# Altium schematic sheet PAGE2 - PWR, MODULE.SchDoc (part 2 of 3)
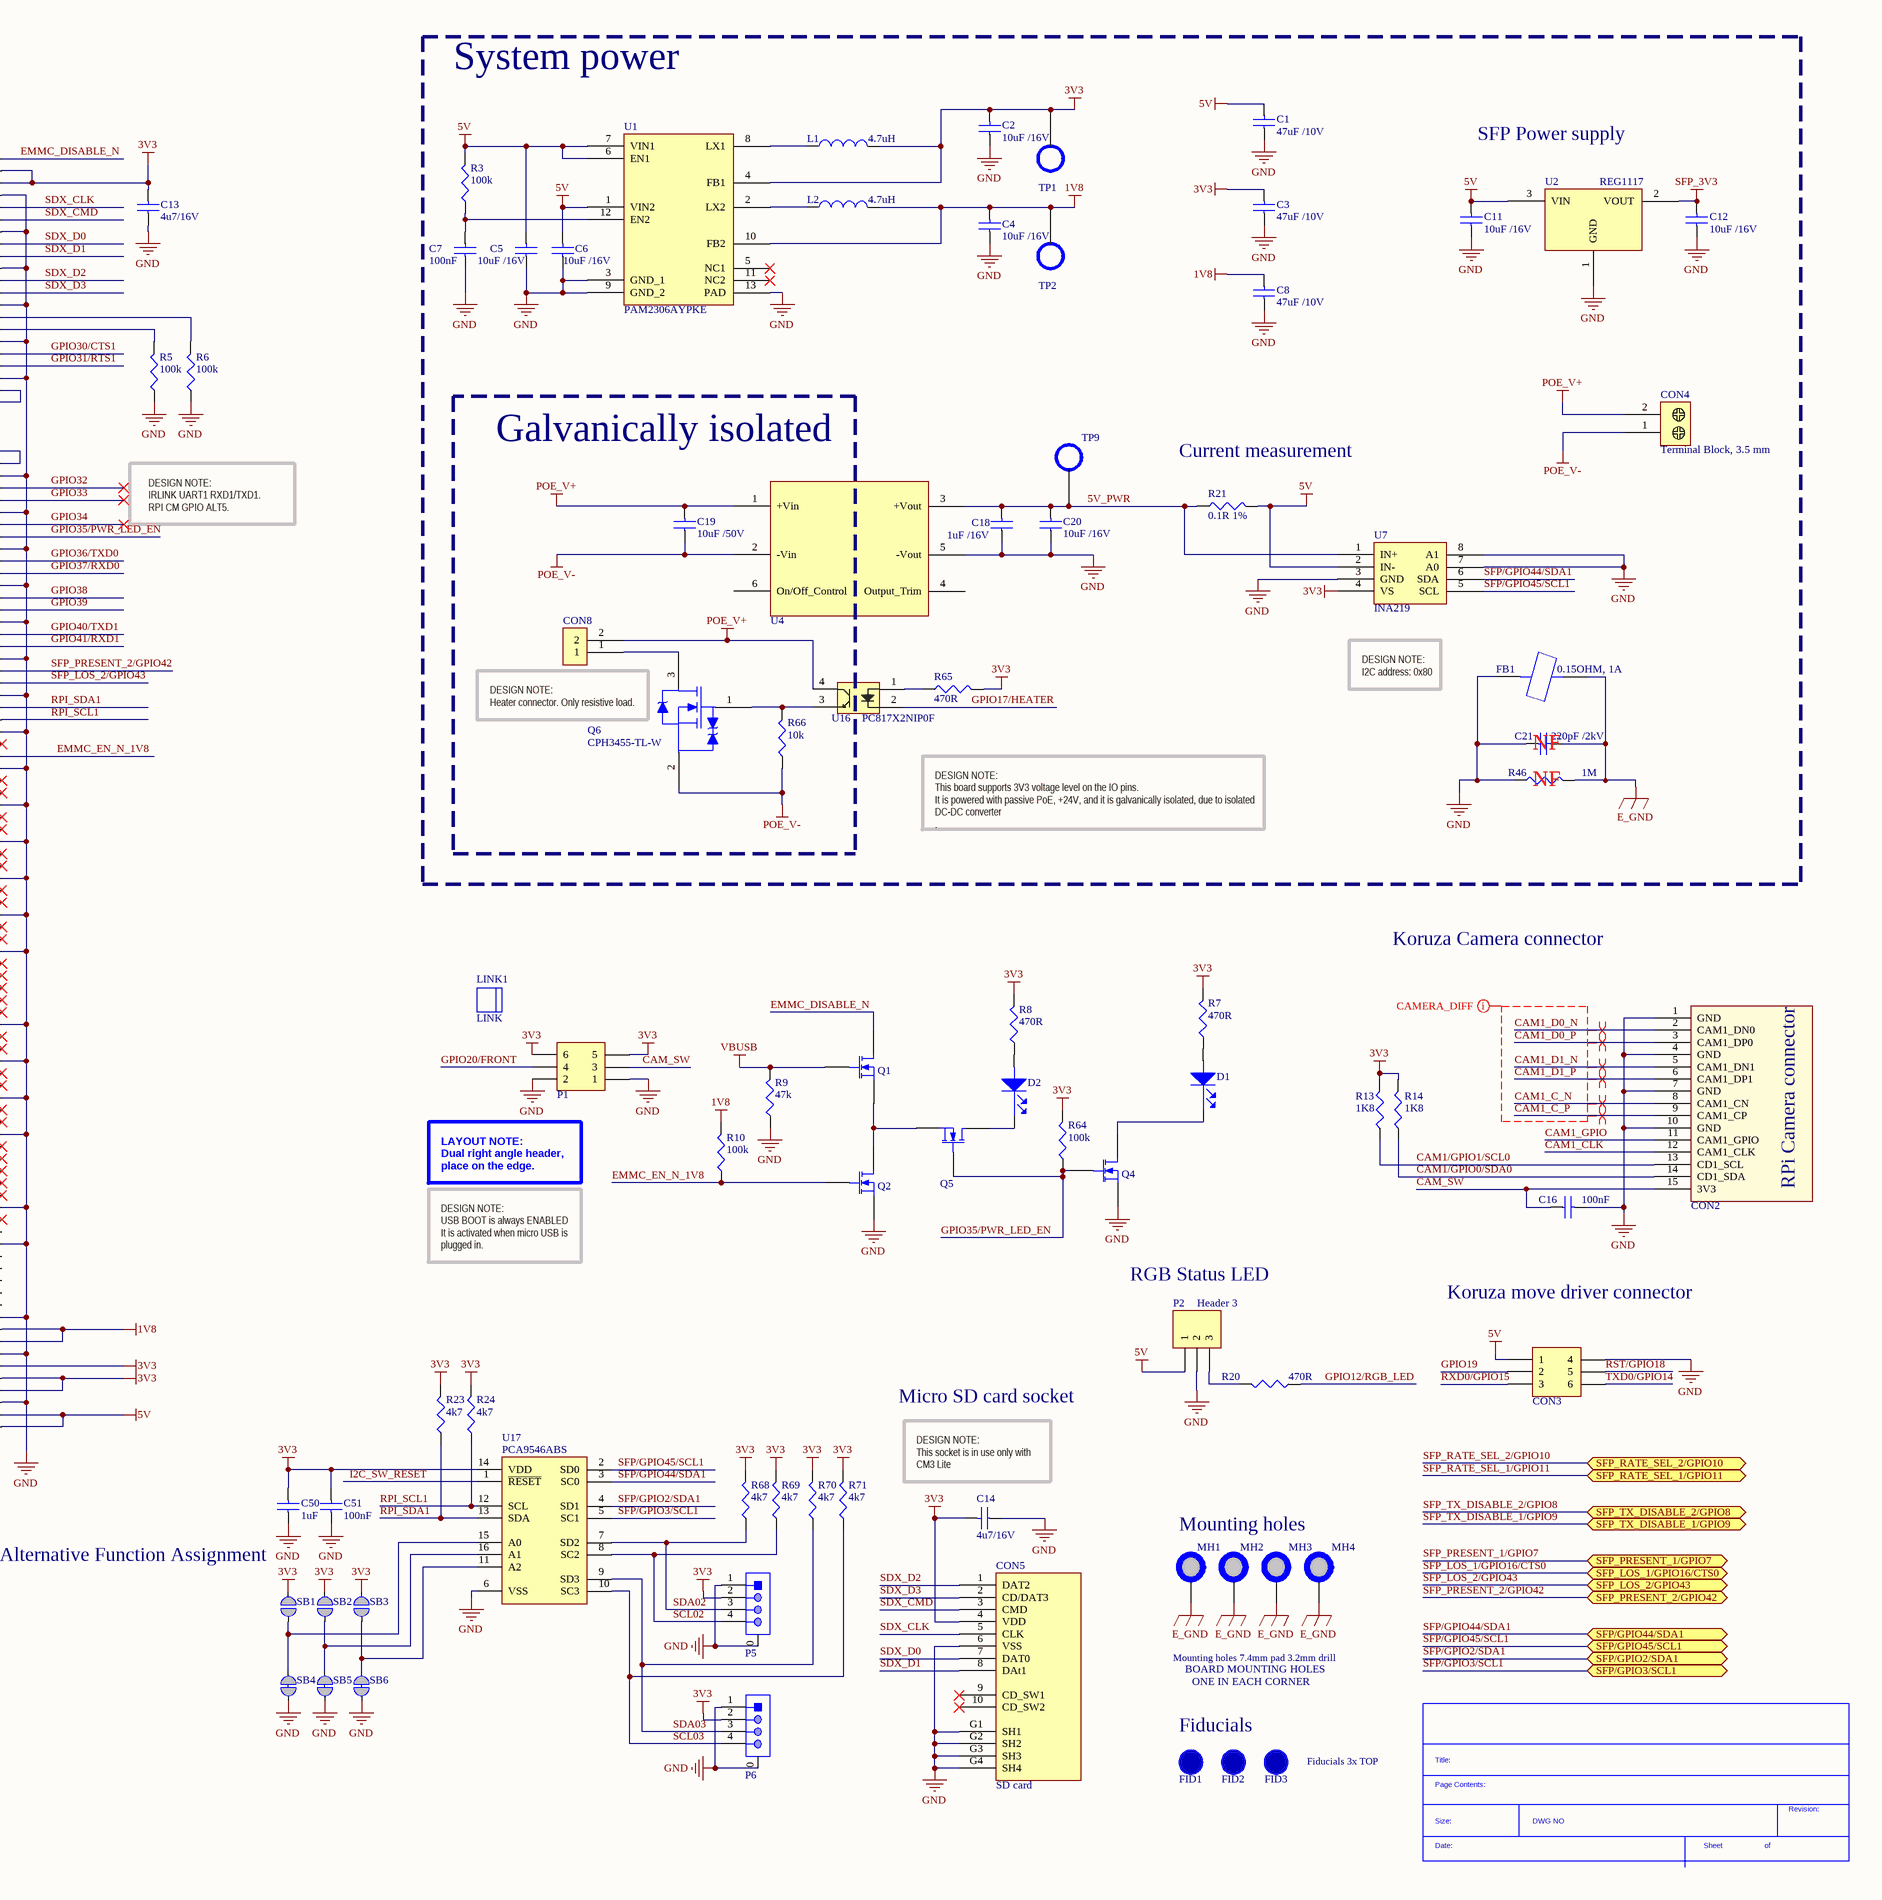
[diagram p2: PAGE2 - PWR, MODULE.SchDoc, right]
## Library data of the parts
C1 C3 C8 = GRM21BR61A476ME15L: MURATA - GRM21BR61A476ME15L - CAP, MLCC, X5R, 47UF, 10V, 0805; Ceramic Capacitor Case: 0805 [2012 Metric]; Capacitance: 47; Voltage Rating: 10; Capacitance Tolerance: ± 20%; Dielectric Characteristic: X5; Product Range: GRM Series; SVHC: No SVHC (17-Dec-2015; Supplier 1: Farnell; Manufacturer: MURATA; Manufacturer Part Number: GRM21BR61A476ME15L; RoHS: YES; Stock 1: 27604; Pricing 1: 5=0.699, 50=0.295, 250=0.232, 500=0.193, 1500=0.171 (GBP); Packaging: Cut Tape; Operating Temperature Min: -55; Operating Temperature Max: 85; Automotive Qualification Standard: -; MSL: MSL 1 - Unlimited; ComponentLink1URL: http://www.farnell.com/datasheets/2079183.pdf; ComponentLink1Description: http://www.farnell.com/datasheets/2079183.pdf; Supplier Part Number 1: 2611939
C2 C4-C6 C20 = CGA4J1X5R1C106K125AC: TDK - CGA4J1X5R1C106K125AC - CAP, MLCC, X5R, 10UF, 16V, 0805; Supplier 1: Farnell; Manufacturer: TDK; Manufacturer Part Number: CGA4J1X5R1C106K125AC; RoHS: YES; Stock 1: 8974; Pricing 1: 5=0.41, 50=0.146, 250=0.131, 500=0.12, 1000=0.103 (GBP); ComponentLink1URL: http://bcove.me/e1v54mtm; ComponentLink1Description: http://bcove.me/e1v54mtm; ComponentLink2URL: http://www.farnell.com/datasheets/1936565.pdf; ComponentLink2Description: http://www.farnell.com/datasheets/1936565.pdf; ComponentLink3URL: http://www.farnell.com/datasheets/1683658.pdf; ComponentLink3Description: http://www.farnell.com/datasheets/1683658.pdf; Supplier Part Number 1: 2210948RL
C7 C16 = 100nF: MURATA - GRM188R71C104KA01J - CAP, MLCC, X7R, 0.1UF, 16V, 0603; Ceramic Capacitor Case: 0603 [1608 Metric]; Capacitance: 0.1; Voltage Rating: 16; Capacitance Tolerance: ± 10%; Dielectric Characteristic: X7; Product Range: GRM Series; SVHC: No SVHC (20-Jun-2016; Supplier 1: Farnell; Manufacturer: MURATA; Manufacturer Part Number: GRM188R71C104KA01J; RoHS: YES; Stock 1: 18297; Pricing 1: 10=0.0145, 100=0.0126, 500=0.0081, 2500=0.0059, 5000=0.0052, 10000=0.0046, 50000=0.0036, 100000=0.0035 (GBP); Packaging: Cut Tape; Operating Temperature Min: -55; Operating Temperature Max: 125; Automotive Qualification Standard: -; MSL: MSL 1 - Unlimited; ComponentLink1URL: http://www.farnell.com/datasheets/2189124.pdf; ComponentLink1Description: http://www.farnell.com/datasheets/2189124.pdf; Supplier Part Number 1: 2688519
C9 C10 = GRM188R61C105KA12D: MURATA - GRM188R61C105KA12D - CAP, MLCC, X5R, 1UF, 16V, 0603; Ceramic Capacitor Case: 0603 [1608 Metric]; Capacitance: 1; Voltage Rating: 16; Capacitance Tolerance: ± 10%; Dielectric Characteristic: X5; Product Range: GRM Series; SVHC: No SVHC (17-Dec-2015); Capacitance Tolerance ±: ± 10%<!--FANDB--><div class="features-and-benefits-container"><div class="features-and-benefits-description"><span class="features-benefits-value">The Murata GRM series capacitors are Multilayer Ceramic Chip Capacitors (MLCC) used for general purpose applications. These MLCC capacitors are classified into temperature compensating and high dielectric constant types depending on the change in electrostatic capacitance due to change in temperature. The temperature compensating capacitors feature a small rate of change in electrostatic capacitance as the temperature changes and are used for applications such as filters and high frequency circuit matching. The high dielectric constant capacitors use materials with a high dielectric constant and feature a large electrostatic capacitance. Typical applications are power supply decoupling and smoothing circuits.</span></div><div class="features-and-benefits-list"><ul class="features-and-benefits-list-list"><li class="features-and-benefits-list-item">Large capacity and small size in a multilayer structure</li><li class="features-and-benefits-list-item">Capacitance value ranging from 0.1pF to 220?F</li><li class="features-and-benefits-list-item">Tin plated external electrodes, excellent solderability</li><li class="features-and-benefits-list-item">Provides good high frequency characteristics</li><li class="features-and-benefits-list-item">Excellent pulse response</li><li class="features-and-benefits-list-item">High reliability</li><li class="features-and-benefits-list-item">Capacitor size varies from 0.4×0.2mm to 5.7×5.0mm</li><li class="features-and-benefits-list-item">Rated voltage of 2.5VDC to 3.15; Supplier 1: Farnell; Manufacturer: MURATA; Manufacturer Part Number: GRM188R61C105KA12D; RoHS: YES; Stock 1: 27380; Pricing 1: 10=0.0194, 100=0.013, 500=0.0101, 1000=0.0078, 2000=0.0074 (GBP); Packaging: Cut Tape; Operating Temperature Min: -55; Operating Temperature Max: 85; Automotive Qualification Standard: -; MSL: MSL 1 - Unlimited; ComponentLink1URL: http://www.farnell.com/datasheets/2047881.pdf; ComponentLink1Description: http://www.farnell.com/datasheets/2047881.pdf; ComponentLink2URL: http://www.farnell.com/datasheets/2006461.pdf; ComponentLink2Description: http://www.farnell.com/datasheets/2006461.pdf; Supplier Part Number 1: 2362099RL
C11 C12 = GRM188R61C106MA73D: MURATA - GRM188R61C106MA73D - CAP, MLCC, X5R, 10UF, 16V, 0603; Ceramic Capacitor Case: 0603 [1608 Metric]; Capacitance: 10; Voltage Rating: 16; Capacitance Tolerance: ± 20%; Dielectric Characteristic: X5; Product Range: GRM Series; SVHC: No SVHC (17-Dec-2015)<!--FANDB--><div class="features-and-benefits-container"><div class="features-and-benefits-description"><span class="features-benefits-value">The Murata GRM series capacitors are Multilayer Ceramic Chip Capacitors (MLCC) used for general purpose applications. These MLCC capacitors are classified into temperature compensating and high dielectric constant types depending on the change in electrostatic capacitance due to change in temperature. The temperature compensating capacitors feature a small rate of change in electrostatic capacitance as the temperature changes and are used for applications such as filters and high frequency circuit matching. The high dielectric constant capacitors use materials with a high dielectric constant and feature a large electrostatic capacitance. Typical applications are power supply decoupling and smoothing circuits.</span></div><div class="features-and-benefits-list"><ul class="features-and-benefits-list-list"><li class="features-and-benefits-list-item">Large capacity and small size in a multilayer structure</li><li class="features-and-benefits-list-item">Capacitance value ranging from 0.1pF to 220?F</li><li class="features-and-benefits-list-item">Tin plated external electrodes, excellent solderability</li><li class="features-and-benefits-list-item">Provides good high frequency characteristics</li><li class="features-and-benefits-list-item">Excellent pulse response</li><li class="features-and-benefits-list-item">High reliability</li><li class="features-and-benefits-list-item">Capacitor size varies from 0.4×0.2mm to 5.7×5.0mm</li><li class="features-and-benefits-list-item">Rated voltage of 2.5VDC to 3.15; Supplier 1: Farnell; Manufacturer: MURATA; Manufacturer Part Number: GRM188R61C106MA73D; RoHS: YES; Stock 1: 21735; Pricing 1: 10=0.181, 100=0.103, 500=0.0863, 1000=0.0778, 2000=0.0677 (GBP); Packaging: Cut Tape; Operating Temperature Min: -55; Operating Temperature Max: 85; Automotive Qualification Standard: -; MSL: -; ComponentLink1URL: http://www.farnell.com/datasheets/2048226.pdf; ComponentLink1Description: http://www.farnell.com/datasheets/2048226.pdf; Supplier Part Number 1: 2426958
C13 C14 = 4u7  16V 0603: MURATA - GRM188R61C475KAAJD - CAP, MLCC, X5R, 4.7UF, 16V, 0603; Ceramic Capacitor Case: 0603 [1608 Metric]; Capacitance: 4.7; Voltage Rating: 16; Capacitance Tolerance: ± 10%; Dielectric Characteristic: X5; Product Range: GRM Series; SVHC: No SVHC (17-Dec-2015)<!--FANDB--><div class="features-and-benefits-container"><div class="features-and-benefits-desc-container"><span class="features-and-benefits-container-desc">SMD Multilayer Ceramic Capacitor, 0603 [1608 Metric], 4.7 µF, 16 V, ± 10%, X5; Supplier 1: Farnell; Manufacturer: MURATA; Manufacturer Part Number: GRM188R61C475KAAJD; RoHS: YES; Stock 1: 5038; Pricing 1: 10=0.16, 100=0.0929, 500=0.076, 1000=0.0618, 2000=0.0605, 4000=0.0425, 20000=0.0409, 40000=0.0355 (GBP); Packaging: Cut Tape; Operating Temperature Min: -55; Operating Temperature Max: 85; Automotive Qualification Standard: -; MSL: MSL 1 - Unlimited; ComponentLink1URL: http://www.farnell.com/datasheets/2079168.pdf; ComponentLink1Description: http://www.farnell.com/datasheets/2079168.pdf; Supplier Part Number 1: 2611924
C18 = GRM21BR71C105KA01L: MURATA - GRM21BR71C105KA01L - CAP, MLCC, X7R, 1UF, 16V, 0805; Supplier 1: Farnell; Manufacturer: MURATA; Manufacturer Part Number: GRM21BR71C105KA01L; RoHS: YES; Stock 1: 58053; Pricing 1: 5=0.0398, 50=0.0331, 250=0.0235, 500=0.022, 1500=0.018 (GBP); ComponentLink1URL: http://www.farnell.com/datasheets/2047889.pdf; ComponentLink1Description: http://www.farnell.com/datasheets/2047889.pdf; ComponentLink2URL: http://www.farnell.com/cad/1547313.zip; ComponentLink2Description: http://www.farnell.com/cad/1547313.zip; ComponentLink3URL: http://www.farnell.com/datasheets/2006461.pdf; ComponentLink3Description: http://www.farnell.com/datasheets/2006461.pdf; Supplier Part Number 1: 9527710
C19 = GRM31CR61H106KA12L: MURATA - GRM31CR61H106KA12L - CAP, MLCC, X5R, 10UF, 50V, 1206; Supplier 1: Farnell; Manufacturer: MURATA; Manufacturer Part Number: GRM31CR61H106KA12L; RoHS: YES; Stock 1: 51830; Pricing 1: 5=0.368, 50=0.214, 250=0.196, 500=0.178, 1000=0.159 (GBP); ComponentLink1URL: http://www.farnell.com/datasheets/2048767.pdf; ComponentLink1Description: http://www.farnell.com/datasheets/2048767.pdf; Supplier Part Number 1: 1845762
C21 = 220pF /2kV: KEMET - C1206C221KGRACTU - CAP, MLCC, X7R, 220PF, 2KV, 1206; Supplier 1: Farnell; Manufacturer: KEMET; Manufacturer Part Number: C1206C221KGRACTU; RoHS: YES; Stock 1: 1984; Pricing 1: 5=0.153, 50=0.0991, 250=0.0793, 500=0.0671, 1000=0.0581, 2500=0.0484, 12500=0.0415, 25000=0.0363 (GBP); ComponentLink1URL: http://www.farnell.com/datasheets/2180568.pdf; ComponentLink1Description: http://www.farnell.com/datasheets/2180568.pdf; Supplier Part Number 1: 2676444RL
C50 = C - 1uF: MURATA - GRM188R61H105KAALD - CAP, MLCC, X5R, 1UF, 50V, 0603; IRNAS Part No.: I-200006; Ceramic Capacitor Case: 0603 [1608 Metric]; Capacitance: 1; Voltage Rating: 50; Capacitance Tolerance: ± 10%; Dielectric Characteristic: X5; Product Range: GRM Series; SVHC: No SVHC (17-Dec-2015); Capacitor Terminals: SMD<!--FANDB--><div class="features-and-benefits-container"><div class="features-and-benefits-description"><span class="features-benefits-value">The Murata GRM series capacitors are Multilayer Ceramic Chip Capacitors (MLCC) used for general purpose applications. These MLCC capacitors are classified into temperature compensating and high dielectric constant types depending on the change in electrostatic capacitance due to change in temperature. The temperature compensating capacitors feature a small rate of change in electrostatic capacitance as the temperature changes and are used for applications such as filters and high frequency circuit matching. The high dielectric constant capacitors use materials with a high dielectric constant and feature a large electrostatic capacitance. Typical applications are power supply decoupling and smoothing circuits.</span></div><div class="features-and-benefits-list"><ul class="features-and-benefits-list-list"><li class="features-and-benefits-list-item">Large capacity and small size in a multilayer structure</li><li class="features-and-benefits-list-item">Capacitance value ranging from 0.1pF to 220?F</li><li class="features-and-benefits-list-item">Tin plated external electrodes, excellent solderability</li><li class="features-and-benefits-list-item">Provides good high frequency characteristics</li><li class="features-and-benefits-list-item">Excellent pulse response</li><li class="features-and-benefits-list-item">High reliability</li><li class="features-and-benefits-list-item">Capacitor size varies from 0.4×0.2mm to 5.7×5.0mm</li><li class="features-and-benefits-list-item">Rated voltage of 2.5VDC to 3.15; Supplier 1: Farnell; Manufacturer: MURATA; Manufacturer Part Number: GRM188R61H105KAALD; RoHS: YES; Stock 1: 62682; Pricing 1: 10=0.093, 100=0.062, 500=0.0507, 1000=0.0465, 2000=0.0429, 4000=0.0399, 20000=0.0372, 40000=0.0365 (GBP); Packaging: Cut Tape; Operating Temperature Min: -55; Operating Temperature Max: 85; Automotive Qualification Standard: -; MSL: -; Capacitance Tolerance ±: ± 10%; ComponentLink1URL: http://www.farnell.com/datasheets/2048611.pdf; ComponentLink1Description: http://www.farnell.com/datasheets/2048611.pdf; Supplier Part Number 1: 1845736
C51 = C - 100nF: MURATA - GRM188R71C104KA01J - CAP, MLCC, X7R, 0.1UF, 16V, 0603; IRNAS Part No.: I-200005; Ceramic Capacitor Case: 0603 [1608 Metric]; Capacitance: 0.1; Voltage Rating: 16; Capacitance Tolerance: ± 10%; Dielectric Characteristic: X7; Product Range: GRM Series; SVHC: No SVHC (20-Jun-2016; Supplier 1: Farnell; Manufacturer: MURATA; Manufacturer Part Number: GRM188R71C104KA01J; RoHS: YES; Stock 1: 18297; Pricing 1: 10=0.0145, 100=0.0126, 500=0.0081, 2500=0.0059, 5000=0.0052, 10000=0.0046, 50000=0.0036, 100000=0.0035 (GBP); Packaging: Cut Tape; Operating Temperature Min: -55; Operating Temperature Max: 125; Automotive Qualification Standard: -; MSL: MSL 1 - Unlimited; ComponentLink1URL: http://www.farnell.com/datasheets/2189124.pdf; ComponentLink1Description: http://www.farnell.com/datasheets/2189124.pdf; Supplier Part Number 1: 2688519
CM1 = RPI COMPUTE MODULE: RASPBERRY-PI - RPI COMPUTE MODULE - COMPUTE MODULE, RASPBERRY PI DEV BOARD; Silicon Manufacturer: Broadcom; Core Architecture: ARM; Core Sub-Architecture: ARM1176; Silicon Core Number: BCM2835; Silicon Family Name: BCM2; For Use With: Raspberry Pi Compute Development Kit; Kit Contents: Compute Module BCM2835; Kit Features: Flexible & Rapid Prototype Development, Small & Powerful, Many More GPIOs & Interfaces<!--FANDB--><div class="features-and-benefits-container"><div class="features-and-benefits-desc-container"><span class="features-and-benefits-container-desc">Raspberry Pi Compute Module</span></div><div class="features-and-benefits-description"><span class="features-benefits-value">Flexible & Rapid Prototype Development, Small & Powerful, Many More GPIOs & Interfaces</span></div><div class="features-and-benefits-list"><ul class="features-and-benefits-list-list"><li class="features-and-benefits-list-item">Flexible & Rapid Prototype Development, Small & Powerful, Many More GPIOs & Interfaces</li></ul></div></div>; Supplier 1: Farnell; Manufacturer: RASPBERRY-PI; Manufacturer Part Number: RPI COMPUTE MODULE; RoHS: YES; Pricing 1: 1=19.5 (GBP); Product Range: -; Features: 512MB RAM, SODIMM Sized 6.5cm by 3cm Board, 200pin Edge Connector, On-board 4; ComponentLink1URL: http://bcove.me/qikksixg; ComponentLink1Description: http://bcove.me/qikksixg; ComponentLink2URL: http://www.farnell.com/datasheets/1829397.pdf; ComponentLink2Description: http://www.farnell.com/datasheets/1829397.pdf; Supplier Part Number 1: 2427122
CON1 = RPi CM CON: DDR2 SODIMM connector for Raspberry Pi compute module 1/3/3-Lite; Manufacturer: AMP - TE CONNECTIVITY; Connector Type: Memory Socket; No. of Contacts: 200; SVHC: No SVHC (15-Jun-2015); Contact Termination: Surface Mount Right Angle; Contact Termination Type: Surface Mount; Pitch Spacing: 0.6; Range: Standard; Row Pitch: 6.2mm<!--FANDB--><div class="features-and-benefits-container"><div class="features-and-benefits-description"><span class="features-benefits-value">The 1473005-4 from TE Connectivity is a standard type DDR2 SODIMM socket. It is a 0.6mm pitch, 200 positions, semi hard tray DDR2 socket.</span></div><div class="features-and-benefits-list"><ul class="features-and-benefits-list-list"><li class="features-and-benefits-list-item">Right angled orientation</li><li class="features-and-benefits-list-item">2 rows and 2 bays</li><li class="features-and-benefits-list-item">DRAM voltage and SGRAM voltage?is 1.8; Supplier 1: Farnell; Supplier Part Number 1: 1095877; Manufacturer Part Number: 1473005-4; RoHS: YES; Stock 1: 735; Pricing 1: 1=3.72, 25=2.82, 100=2.62, 250=2.53, 500=2.49, 2000=2.45, 3000=2.41, 5000=2.37 (GBP); Product Range: -; Contact Material: Copper; Contact Plating: Gold Plated Contacts; Lead Spacing: 0.6; Orientation: Right Angle; ComponentLink1URL: http://www.farnell.com/datasheets/2258267.pdf; ComponentLink1Description: http://www.farnell.com/datasheets/2258267.pdf; ComponentLink2URL: http://www.farnell.com/cad/1649684.pdf; ComponentLink2Description: http://www.farnell.com/cad/1649684.pdf; ComponentLink3URL: http://www.farnell.com/datasheets/582309.pdf; ComponentLink3Description: http://www.farnell.com/datasheets/582309.pdf
CON2 = Camera con 15 pin: Raspberry Pi camera connector; Manufacturer: TE Connectivity / AMP; Current Rating: 1 A; Gender: Female; Mounting Angle: Vertical; Number of Positions: 15 Position; Voltage Rating: 125 V; Pitch: 1 mm; Actuation Type: ZIF; Value: Camera; Datasheet: http://www.mouser.com/ds/2/418/NG_CD_1734248_E1__-658235.pdf; Manufacturer Part Number: 1-1734248-5; Supplier 1: Mouser; RoHS: RoHS Compliant; Category: FFC & FPC Connectors; Stock 1: 1477; Pricing 1: 1=1.67, 25=1.53, 50=1.42, 100=1.26, 500=1.17, 1000=1.10, 2500=0.952 (EUR); Contact Plating: Gold; Housing Material: Polyamide (PA); Product: Board Mount; Series: FPC; Temperature Range: - 20 C to + 85 C; Termination Style: SMD; Brand: TE Connectivity / AMP; Contact Material: Phosphor Bronze; Standard Pack Qty: 1000; RoHS - Mouser: Y; Minimum Order Quantity: 1; Reeling: False; ComponentLink1URL: http://www.mouser.com/ds/2/418/NG_CD_1734248_E1__-658235.pdf; ComponentLink1Description: http://www.mouser.com/ds/2/418/NG_CD_1734248_E1__-658235.pdf; Supplier Part Number 1: 571-1-1734248-5
CON3 = 188275-6: AMP - TE CONNECTIVITY - 188275-6 - CONNECTOR, RCPT, 6POS, 2ROW, 1.27MM; Supplier 1: Farnell; Manufacturer: AMP - TE CONNECTIVITY; Manufacturer Part Number: 188275-6; RoHS: YES; Stock 1: 82; Pricing 1: 10=0.616, 50=0.561, 100=0.517, 250=0.482, 500=0.448, 1000=0.395 (GBP); ComponentLink1URL: http://www.farnell.com/cad/1942471.pdf; ComponentLink1Description: http://www.farnell.com/cad/1942471.pdf; Supplier Part Number 1: 2452479
CON4 = 1776275-2: TE CONNECTIVITY - 1776275-2 - TERMINAL BLOCK, WIRE TO BRD, 2POS, 18AWG; Pitch Spacing: 3.5; No. of Positions: 2; Wire Size AWG Min: 26; Wire Size AWG Max: 18; Conductor Area CSA: 0.9; Wire Connection Method: Screw; Rated Current: 7; Rated Voltage: 250; Block Orientation: Through Hole Right Angle; SVHC: No SVHC (15-Jun-2015); Approval Bodies: CSA, UL; Connector Mounting: PCB Mount; Connector Type: Terminal Block, PCB; Contact Current Rating: 10; Wire Area Size Max: 2.08mm²<!--FANDB--><div class="features-and-benefits-container"><div class="features-and-benefits-description"><span class="features-benefits-value">The 1776275-2 from TE Connectivity is a through hole, 2 position vertical PCB mount terminal block with interlocking. This terminal block comes with 3.5mm pitch spacing and is suitable for wire size ranging from 26AWG to 18; Supplier 1: Farnell; Manufacturer: TE CONNECTIVITY; Manufacturer Part Number: 1776275-2; RoHS: Y-EX; Stock 1: 22978; Pricing 1: 1=0.198, 50=0.148, 150=0.141, 250=0.135, 500=0.128, 1500=0.123 (GBP); Product Range: -; Colour: Blue; Contact Material: Brass; Contact Plating: Tin Plated Contacts; Lead Spacing: 3.5; Voltage Rating VAC: 250; ComponentLink1URL: http://www.farnell.com/datasheets/1899918.pdf; ComponentLink1Description: http://www.farnell.com/datasheets/1899918.pdf; ComponentLink2URL: http://www.farnell.com/cad/2291290.pdf; ComponentLink2Description: http://www.farnell.com/cad/2291290.pdf; ComponentLink3URL: http://www.farnell.com/datasheets/1650926.pdf; ComponentLink3Description: http://www.farnell.com/datasheets/1650926.pdf; ComponentLink4URL: http://www.farnell.com/datasheets/2159487.pdf; ComponentLink4Description: http://www.farnell.com/datasheets/2159487.pdf; Supplier Part Number 1: 1098611
CON5 = SD card socket SMD: CONN MICRO SD CARD PUSH-PULL R/A; Manufacturer: Molex, LLC; Manufacturer Part Number: 1040310811; Card Type: Secure Digital - microSD™; Number of Positions: 10 (8 + 2); Connector Type: Connector; Insertion, Removal Method: Push In, Pull Out; Supplier 1: Digi-Key; RoHS: RoHS Compliant; Category: Connectors, Interconnects; Stock 1: 22429; Pricing 1: 1=1.92, 10=1.742, 25=1.6352, 50=1.564, 100=1.493, 250=1.35076, 500=1.24412, 1000=1.0664 (USD); Packaging: Cut Tape (CT); Part Status: Active; Ejector Side: -; Mounting Type: Surface Mount, Right Angle; Features: -; Height Above Board: 0.056" (1.42mm); Mounting Feature: Normal, Standard - Top; Contact Finish: Gold; Contact Finish Thickness: 8µin (0.20µm); ComponentLink1URL: http://www.molex.com/pdm_docs/sd/1040310811_sd.pdf; ComponentLink1Description: http://www.molex.com/pdm_docs/sd/1040310811_sd.pdf; Supplier Part Number 1: WM6357CT-ND
CON8 = 68001-402HLF: Headers & Wire Housings 2P VERT HDR; Manufacturer: Amphenol FCI; Current Rating: 3 A; Mounting Angle: Vertical; Number of Positions: 2 Position; Voltage Rating: 1.5 kV; Pitch: 2.54 mm; Insulation Resistance: 5000 MOhms; Mating Post Length: 5.84 mm; Supplier 1: Mouser; Manufacturer Part Number: 68001-402HLF; RoHS: RoHS Compliant; Category: Headers & Wire Housings; Stock 1: 11486; Pricing 1: 1=0.113, 10=0.104, 100=0.064, 500=0.053, 1000=0.046, 2500=0.042, 5000=0.040, 10000=0.039, 25000=0.036 (EUR); Contact Plating: Tin; Housing Material: Thermoplastic; Number of Rows: 1 Row; Operating Temperature Range: - 65 C to + 125 C; Packaging: Bulk; Product: Headers; Series: 68001; Termination Style: Through Hole; Type: Unshrouded; Brand: Amphenol FCI; Contact Material: Phosphor Bronze; Flammability Rating: UL 94 V-0; Mounting Style: -; Contact Gender: Pin (Male); Housing Gender: -; Standard Pack Qty: 100; Termination Post Length: 3.05 mm; Tradename: BergStik; RoHS - Mouser: Y; Minimum Order Quantity: 1; Reeling: False; ComponentLink1URL: http://www.mouser.com/ds/2/18/bus-12-050-943077.pdf; ComponentLink1Description: http://www.mouser.com/ds/2/18/bus-12-050-943077.pdf
D1 D2 = HSMS-C190: BROADCOM LIMITED - HSMS-C190 - LED, RED, 10MCD, 626NM; LED Mounting: SMD; Forward Current If: 20; Forward Voltage: 2.1; Wavelength Typ: 626; Luminous Intensity: 10; Viewing Angle: 170°; Lens Shape: Rectangular; SVHC: No SVHC (17-Dec-2015)<!--FANDB--><div class="features-and-benefits-container"><div class="features-and-benefits-description"><span class="features-benefits-value">The HSMS-C190 is a HER SMD Chip LED with untinted/diffused lens, made of GaP. It is designed in an industry standard package 1.6 x 0.8mm footprint with 0.8mm profile. It is compatible with IR reflow solder processes. The small size and wide viewing angle make this LED prime choices for backlighting applications and front panel illumination especially where space is a premium.</span></div><div class="features-and-benefits-list"><ul class="features-and-benefits-list-list"><li class="features-and-benefits-list-item">Small size</li><li class="features-and-benefits-list-item">Industry standard footprint</li><li class="features-and-benefits-list-item">Compatible with IR solder</li><li class="features-and-benefits-list-item">Diffused optics</li><li class="features-and-benefits-list-item">-40 to 85; Supplier 1: Farnell; Manufacturer: BROADCOM LIMITED; Manufacturer Part Number: HSMS-C190; RoHS: YES; Stock 1: 7534; Pricing 1: 1=0.361, 10=0.256, 50=0.235, 100=0.106, 200=0.101 (GBP); LED Colour: Red; Bulb Size: -; Packaging: Cut Tape; Product Range: -; Automotive Qualification Standard: -; MSL: -; ComponentLink1URL: http://www.farnell.com/datasheets/313031.pdf; ComponentLink1Description: http://www.farnell.com/datasheets/313031.pdf; ComponentLink2URL: http://www.farnell.com/datasheets/1681524.pdf; ComponentLink2Description: http://www.farnell.com/datasheets/1681524.pdf; ComponentLink3URL: http://www.farnell.com/datasheets/2165483.pdf; ComponentLink3Description: http://www.farnell.com/datasheets/2165483.pdf; Supplier Part Number 1: 2497356
FB1 = MPZ1608D101B: TDK - MPZ1608D101B - FERRITE BEAD, 0.15OHM, 1A, 0603; Impedance @ 100MHz: 0.15; Ferrite Case Style: 0603 [1608 Metric]; Product Range: MPZ Series; DC Current Rating: 1; Impedance Tolerance: ± 25%; SVHC: No SVHC (15-Jun-2015); Ferrite Mounting: SMD; Resistance: 0.15ohm<!--FANDB--><div class="features-and-benefits-container"><div class="features-and-benefits-description"><span class="features-benefits-value">The TDK MPZ 1608 series are chip ferrite beads used for automobiles and power supply circuits. They are convenient components which exert effects as noise suppression measures by simply being inserted into circuits in series unlike bypass capacitors. Multilayer integration monolithic structure makes it highly reliable and has low direct current resistance for compatibility with large currents. Typical applications are engine control units, powertrains and car multimedia (telematics).</span></div><div class="features-and-benefits-list"><ul class="features-and-benefits-list-list"><li class="features-and-benefits-list-item">EIA 1608 standard chip size</li><li class="features-and-benefits-list-item">Impedance values at 100MHz is 120 ohm, 470 ohm</li><li class="features-and-benefits-list-item">Operating temperature range -55°C to 125; Supplier 1: Farnell; Manufacturer: TDK; Manufacturer Part Number: MPZ1608D101B; RoHS: YES; Stock 1: 22074; Pricing 1: 10=0.0643, 100=0.0326, 500=0.0261, 1000=0.021, 2000=0.02, 4000=0.0189, 20000=0.0179, 40000=0.0168 (GBP); DC Resistance Max: 0.15; Automotive Qualification Standard: -; Core Material: Ferrite; Packaging: Cut Tape; ComponentLink1URL: http://www.farnell.com/datasheets/84903.pdf; ComponentLink1Description: http://www.farnell.com/datasheets/84903.pdf; ComponentLink2URL: http://www.farnell.com/datasheets/2039849.pdf; ComponentLink2Description: http://www.farnell.com/datasheets/2039849.pdf; Supplier Part Number 1: 1669740
FID1-FID3 = FID_1MMC: Fiducial 40mil Diameter, 120mil Mask; Supplier: Digikey
L1 L2 = Inductor: Code_IEC: 1005; Published: 8-Jun-2000; LatestRevisionDate: 29-May-2009; LatestRevisionNote: IPC-7351 Footprint Added.; PackageReference: 0402-A; Publisher: Altium Limited; PackageDescription: Chip Inductor; Code_JEITA: 0402; Datasheet: http://www.farnell.com/datasheets/1684089.pdf?_ga=1.209403153.2093911144.1482135861; Supplier 2: Farnell; Supplier Part Number 2: 2408944; Supplier 1: Farnell; Supplier Part Number 1: 2408944
LINK1 = QPC02SXGN-RC: CONN JUMPER SHORTING .100" GOLD; Manufacturer: Sullins Connector Solutions; Gender: Female Sockets; Number of Positions or Pins (Grid): 2 (1 x 2); Pitch: 0.100" (2.54mm); .Checked SCH: used; Supplier 1: Digi-Key; Supplier Part Number 1: S9337-ND; Manufacturer Part Number: QPC02SXGN-RC; RoHS: RoHS Compliant; Category: Connectors, Interconnects; Stock 1: 23274; Pricing 1: 1=0.11, 10=0.066, 25=0.0468, 50=0.0384, 100=0.033, 250=0.02792, 500=0.0258, 1000=0.0228, 2500=0.018 (USD); Type: Open Top; Height: 0.235" (5.97mm); Contact Finish: Gold; Contact Finish Thickness: Flash; Color: -; Packaging: Bulk; ComponentLink1URL: http://www.sullinscorp.com/drawings/284_SXGN_11510.pdf; ComponentLink1Description: http://www.sullinscorp.com/drawings/284_SXGN_11510.pdf
MH1-MH4 = MH_7.4MMNC_3.2MMD: Mounting Hole 7.4mm Diameter (Non Copper), 3.2mm Drill NPTH
P2 = Header 3: Header, 3-Pin; LatestRevisionDate: 17-Jul-2002; LatestRevisionNote: Re-released for DXP Platform.; Publisher: Altium Limited
P3 = MHDR2X15: Header, 15-Pin, Dual row; LatestRevisionDate: 17-Jul-2002; LatestRevisionNote: Re-released for DXP Platform.; Publisher: Altium Limited
P5 P6 = JST - BM04B-SRSS-TB(LF)(SN): Pin Header, Top Entry, Wire-to-Board, 1 mm, 1 Rows, 4 Contacts, Surface Mount, SR Series; Pin Number: 4; Pitch: 1mm; Gender: Male; ComponentLink1Description: Manufacturer; ComponentLink1URL: http://www.we-online.de; ComponentLink2Description: Datasheet; ComponentLink2URL: http://katalog.we-online.de/em/datasheet/691305130004.pdf; Part Number: BM04B-SRSS-TB(LF)(SN); Published Date: June 2018; Publisher: JST; Operating Temperature: -40 to 105 degC; Mounting Technology: THT; Packaging: Box; Supplier 1: Farnell; Supplier Part Number 1: 1679129
Q1 Q2 Q4 Q5 = DMG1012T-7: MOSFET MOSFET N-CHANNEL SOT-523; Manufacturer: Diodes Incorporated; Configuration: 1 N-Channel; Number of Channels: 1 Channel; Channel Mode: Enhancement; Fall Time: 12.3 ns; Id - Continuous Drain Current: 630 mA; Pd - Power Dissipation: 280 mW; Qg - Gate Charge: 736.6 pC; Rds On - Drain-Source Resistance: 300 mOhms; Rise Time: 7.4 ns; Typical Turn-Off Delay Time: 26.7 ns; Typical Turn-On Delay Time: 5.1 ns; Vds - Drain-Source Breakdown Voltage: 20 V; Vgs - Gate-Source Voltage: +/- 6 V; Vgs th - Gate-Source Threshold Voltage: 500 mV; Supplier 1: Mouser; Manufacturer Part Number: DMG1012T-7; RoHS: RoHS Compliant; Category: MOSFET; Stock 1: 1195; Pricing 1: 1=0.273, 10=0.187, 100=0.077, 1000=0.053, 3000=0.041, 9000=0.035, 24000=0.033, 45000=0.031, 99000=0.027 (EUR); Package/Case: SOT-523-3; Packaging: Reel; Product: MOSFET Small Signal; Series: DMG1012; Technology: Si; Transistor Type: 1 N-Channel; Brand: Diodes Incorporated; Mounting Style: SMD/SMT; Transistor Polarity: N-Channel; Maximum Operating Temperature: + 150 C; Minimum Operating Temperature: - 55 C; Standard Pack Qty: 3000; RoHS - Mouser: Y; Minimum Order Quantity: 1; Reeling: True; ComponentLink1URL: http://www.mouser.com/ds/2/115/ds31783-44973.pdf; ComponentLink1Description: http://www.mouser.com/ds/2/115/ds31783-44973.pdf; Supplier Part Number 1: 621-DMG1012T-7
Q6 = CPH3455-TL-W: ON SEMICONDUCTOR - CPH3455-TL-W - MOSFET, N-CH, 35V, 3A, CPH-3; Supplier 1: Farnell; Manufacturer: ON SEMICONDUCTOR; Manufacturer Part Number: CPH3455-TL-W; RoHS: YES; Stock 1: 2861; Pricing 1: 1=0.451, 50=0.378, 100=0.203, 250=0.193, 500=0.175, 1000=0.126 (GBP); ComponentLink1URL: http://www.farnell.com/datasheets/2000321.pdf; ComponentLink1Description: http://www.farnell.com/datasheets/2000321.pdf; ComponentLink2URL: http://www.farnell.com/datasheets/2289080.pdf; ComponentLink2Description: http://www.farnell.com/datasheets/2289080.pdf; Supplier Part Number 1: 2508370
R3 R5 R6 R10 R64 = MCMR06X104 JTL: MULTICOMP - MCMR06X104 JTL - RES, CERAMIC, 100K, 5%, 0.1W, 0603; Resistance: 100; Voltage Rating: 75; Resistor Case Style: 0603 [1608 Metric]; Product Range: MCMR Series; Temperature Coefficient: ± 100; Resistor Mounting: Surface Mount Device<!--FANDB--><div class="features-and-benefits-container"><div class="features-and-benefits-description"><span class="features-benefits-value">The Multicomp MCMR series resistors are automotive grade, anti sulphured thick film chip resistor. The resistance range includes E24 and E96 decade values from 1ohm to 10Mohm. These resistors are constructed on top of a high grade ceramic body.</span></div><div class="features-and-benefits-list"><ul class="features-and-benefits-list-list"><li class="features-and-benefits-list-item">EIA 0402, 0603, 0805, 1206 chip sizes available</li><li class="features-and-benefits-list-item">High reliability and stability</li><li class="features-and-benefits-list-item">Automotive grade AEC-Q200 compliant</li><li class="features-and-benefits-list-item">Complaint with (IEC 60068-1) 55/155/56 climatic category</li><li class="features-and-benefits-list-item">Maximum operation voltage of 50V, 75V, 150V and 200V</li><li class="features-and-benefits-list-item">Power rating of 62.5mW, 100mW, 125mW and 250mW</li><li class="features-and-benefits-list-item">Available in ±1% and ±5% tolerance</li><li class="features-and-benefits-list-item">Temperature coefficient (TCR) of +200ppm/°C, +100ppm/°C and -200ppm/°C to +400ppm/°C</li><li class="features-and-benefits-list-item">Operating temperature range -55°C to 155; Supplier 1: Farnell; Manufacturer: MULTICOMP; Manufacturer Part Number: MCMR06X104 JTL; RoHS: Y-EX; Stock 1: 187; Pricing 1: 10=0.0109, 100=0.0085, 500=0.006, 1000=0.0048, 2500=0.004, 5000=0.003, 25000=0.002, 50000=0.0016 (GBP); Power Rating: 100; Resistance Tolerance: ± 5%; Packaging: Cut Tape; Resistor Element Material: Ceramic; Automotive Qualification Standard: -; ComponentLink1URL: http://www.farnell.com/datasheets/1716707.pdf; ComponentLink1Description: http://www.farnell.com/datasheets/1716707.pdf; Supplier Part Number 1: 2073357
R7 R8 R20 = MCMR06X471 JTL: MULTICOMP - MCMR06X471 JTL - RES, CERAMIC, 470R, 5%, 0.1W, 0603; Supplier 1: Farnell; Manufacturer: MULTICOMP; Manufacturer Part Number: MCMR06X471 JTL; RoHS: Y-EX; Stock 1: 3786; Pricing 1: 10=0.0089, 100=0.0076, 500=0.0063, 1000=0.0049, 2500=0.0033, 5000=0.0024, 25000=0.0016, 50000=0.0013 (GBP); ComponentLink1URL: http://www.farnell.com/datasheets/1716707.pdf; ComponentLink1Description: http://www.farnell.com/datasheets/1716707.pdf; Supplier Part Number 1: 2073513
R9 = MCMR06X4702FTL: MULTICOMP - MCMR06X4702FTL - RES, CERAMIC, 47K, 1%, 0.1W, 0603; Resistance: 47; Voltage Rating: 75; Resistor Case Style: 0603 [1608 Metric]; Power Rating: 100; Product Range: MCMR Series; Temperature Coefficient: ± 100; Automotive Qualification Standard: -<!--FANDB--><div class="features-and-benefits-container"><div class="features-and-benefits-description"><span class="features-benefits-value">The Multicomp MCMR series resistors are automotive grade, anti sulphured thick film chip resistor. The resistance range includes E24 and E96 decade values from 1ohm to 10Mohm. These resistors are constructed on top of a high grade ceramic body.</span></div><div class="features-and-benefits-list"><ul class="features-and-benefits-list-list"><li class="features-and-benefits-list-item">EIA 0402, 0603, 0805, 1206 chip sizes available</li><li class="features-and-benefits-list-item">High reliability and stability</li><li class="features-and-benefits-list-item">Automotive grade AEC-Q200 compliant</li><li class="features-and-benefits-list-item">Complaint with (IEC 60068-1) 55/155/56 climatic category</li><li class="features-and-benefits-list-item">Maximum operation voltage of 50V, 75V, 150V and 200V</li><li class="features-and-benefits-list-item">Power rating of 62.5mW, 100mW, 125mW and 250mW</li><li class="features-and-benefits-list-item">Available in ±1% and ±5% tolerance</li><li class="features-and-benefits-list-item">Temperature coefficient (TCR) of +200ppm/°C, +100ppm/°C and -200ppm/°C to +400ppm/°C</li><li class="features-and-benefits-list-item">Operating temperature range -55°C to 155; Supplier 1: Farnell; Manufacturer: MULTICOMP; Manufacturer Part Number: MCMR06X4702FTL; RoHS: Y-EX; Stock 1: 21427; Pricing 1: 10=0.0115, 100=0.009, 500=0.0064, 1000=0.0051, 2500=0.0042, 5000=0.0032, 25000=0.0021, 50000=0.0017 (GBP); Resistance Tolerance: ± 1%; Packaging: Cut Tape; Resistor Element Material: Ceramic; ComponentLink1URL: http://www.farnell.com/datasheets/1716707.pdf; ComponentLink1Description: http://www.farnell.com/datasheets/1716707.pdf; Supplier Part Number 1: 2073510
R13 R14 = CRCW06031K80FKEA: VISHAY - CRCW06031K80FKEA - RES, THICK FILM, 1K8, 1%, 0.1W, 0603; Supplier 1: Farnell; Manufacturer: VISHAY; Manufacturer Part Number: CRCW06031K80FKEA; RoHS: Y-EX; Stock 1: 21649; Pricing 1: 10=0.0105, 100=0.0094, 500=0.0055, 1000=0.005, 2500=0.0038 (GBP); ComponentLink1URL: http://www.farnell.com/datasheets/2111203.pdf; ComponentLink1Description: http://www.farnell.com/datasheets/2111203.pdf; ComponentLink2URL: http://www.farnell.com/cad/1552026.zip; ComponentLink2Description: http://www.farnell.com/cad/1552026.zip; Supplier Part Number 1: 1652854
R16-R19 R22 R25 R26 = CR0603-J/-000ELF: BOURNS - CR0603-J/-000ELF - RES, THICK FILM, 0R, 5%, 0.1W, 0603; Resistance: 0; Voltage Rating: 50; Resistor Case Style: 0603 [1608 Metric]; Power Rating: 100; Product Range: CR Series; SVHC: No SVHC (17-Dec-2015); Resistor Mounting: Surface Mount Device<!--FANDB--><div class="features-and-benefits-container"><div class="features-and-benefits-description"><span class="features-benefits-value">The Bourns CR series are standard thick film chip resistors. These resistors provide flexibility of performance, space saving and low cost. The Resistance range includes E96 and E24 decade values from 1ohm to 10Mohm.</span></div><div class="features-and-benefits-list"><ul class="features-and-benefits-list-list"><li class="features-and-benefits-list-item">0201, 0402, 0603, 0805, 1206, 1210, 2010, 2512 standard case sizes available</li><li class="features-and-benefits-list-item">±1% and ±5% tolerance</li><li class="features-and-benefits-list-item">±100ppm/°C, ±200ppm/°C and ±250ppm/°C TCR values available</li><li class="features-and-benefits-list-item">Power rating selectable for 50mW, 63mW, 0.1W, 0.125W, 0.25W, 0.5W and 1W based on ordering</li><li class="features-and-benefits-list-item">Jumpers are available for all size</li><li class="features-and-benefits-list-item">3 layer termination process with nickel barrier prevents leaching & provides excellent solderability</li><li class="features-and-benefits-list-item">Suitable for all type of soldering processes</li><li class="features-and-benefits-list-item">Tight dimensional tolerances</li><li class="features-and-benefits-list-item">Maximum working voltage depends on case size</li><li class="features-and-benefits-list-item">Operating temperature of -55°C to +125°C(CR0201) and -55°C to +155; Supplier 1: Farnell; Manufacturer: BOURNS; Manufacturer Part Number: CR0603-J/-000ELF; RoHS: YES; Stock 1: 58200; Pricing 1: 10=0.0146, 250=0.0097, 1000=0.0073, 5000=0.0049, 12500=0.0042 (GBP); Resistance Tolerance: ± 5%; Packaging: Cut Tape; Resistor Element Material: Thick Film; Temperature Coefficient: -; Automotive Qualification Standard: -; MSL: MSL 1 - Unlimited; ComponentLink1URL: http://www.bourns.com/engineering/CHPREZTR/cr0603.stp; ComponentLink1Description: http://www.bourns.com/engineering/CHPREZTR/cr0603.stp; ComponentLink2URL: http://www.farnell.com/datasheets/2178762.pdf; ComponentLink2Description: http://www.farnell.com/datasheets/2178762.pdf; Supplier Part Number 1: 2008343
R21 = 0.1R 1% 1206: TE CONNECTIVITY - TL2BR10FTE - RESISTOR, METAL , R10, 0.25W, 1%, 1206; Resistance: 0.1; Power Rating: 250; Resistor Case Style: 1206 [3216 Metric]; Product Range: TL Series; Resistor Element Material: Metal Foil; Temperature Coefficient: ± 75; Automotive Qualification Standard: -<!--FANDB--><div class="features-and-benefits-container"></div>; Supplier 1: Farnell; Manufacturer: TE CONNECTIVITY; Manufacturer Part Number: TL2BR10FTE; RoHS: YES; Stock 1: 1781; Pricing 1: 10=1.07, 100=0.698, 500=0.531, 1000=0.509, 2000=0.487, 4000=0.465, 20000=0.456, 40000=0.446 (GBP); Resistance Tolerance: ± 1%; Packaging: Cut Tape; ComponentLink1URL: http://www.farnell.com/datasheets/580081.pdf; ComponentLink1Description: http://www.farnell.com/datasheets/580081.pdf; Supplier Part Number 1: 2330389
R23 R24 R68-R71 = R - 4k7: MULTICOMP - MCMR06X4701FTL - RES, CERAMIC, 4K7, 1%, 0.1W, 0603; IRNAS Part No.: I-100003; Resistance: 4.7; Voltage Rating: 75; Resistor Case Style: 0603 [1608 Metric]; Power Rating: 100; Product Range: MCMR Series; Temperature Coefficient: ± 100; SVHC: No SVHC (12-Jan-2017)<!--FANDB--><div class="features-and-benefits-container"><div class="features-and-benefits-description"><span class="features-benefits-value">The Multicomp MCMR series resistors are automotive grade, anti sulphured thick film chip resistor. The resistance range includes E24 and E96 decade values from 1ohm to 10Mohm. These resistors are constructed on top of a high grade ceramic body.</span></div><div class="features-and-benefits-list"><ul class="features-and-benefits-list-list"><li class="features-and-benefits-list-item">EIA 0402, 0603, 0805, 1206 chip sizes available</li><li class="features-and-benefits-list-item">High reliability and stability</li><li class="features-and-benefits-list-item">Automotive grade AEC-Q200 compliant</li><li class="features-and-benefits-list-item">Complaint with (IEC 60068-1) 55/155/56 climatic category</li><li class="features-and-benefits-list-item">Maximum operation voltage of 50V, 75V, 150V and 200V</li><li class="features-and-benefits-list-item">Power rating of 62.5mW, 100mW, 125mW and 250mW</li><li class="features-and-benefits-list-item">Available in ±1% and ±5% tolerance</li><li class="features-and-benefits-list-item">Temperature coefficient (TCR) of +200ppm/°C, +100ppm/°C and -200ppm/°C to +400ppm/°C</li><li class="features-and-benefits-list-item">Operating temperature range -55°C to 155; Supplier 1: Farnell; Manufacturer: MULTICOMP; Manufacturer Part Number: MCMR06X4701FTL; RoHS: Y-EX; Stock 1: 218618; Pricing 1: 10=0.0085, 100=0.0051, 500=0.0036, 1000=0.0028, 2500=0.0023 (GBP); Resistance Tolerance: ± 1%; Packaging: Cut Tape; Resistor Element Material: Ceramic; Automotive Qualification Standard: -; ComponentLink1URL: http://www.farnell.com/datasheets/1716707.pdf; ComponentLink1Description: http://www.farnell.com/datasheets/1716707.pdf; Supplier Part Number 1: 2073509
R46 = 1M: MULTICOMP - MC0063W060311M - RES, THICK FILM, 1M, 1%, 0.063W, 0603; Resistance: 1; Voltage Rating: 50; Resistor Case Style: 0603 [1608 Metric]; Power Rating: 63; Product Range: MC Series; Temperature Coefficient: ± 100; SVHC: No SVHC (17-Dec-2015); External Depth: 0.45; External Length / Height: 1.6; External Width: 0.8; No. of Pins: 2; Reel Quantity: 5000; Resistor Mounting: Surface Mount Device; Temperature Coeff. +: 100; Voltage Rating V DC: 50V<!--FANDB--><div class="features-and-benefits-container"><div class="features-and-benefits-description"><span class="features-benefits-value">The Multicomp MC series current sense resistors are thick film chip resistors. The resistance range includes E96 and E24 decade values from 1ohm to 10Mohm.</span></div><div class="features-and-benefits-list"><ul class="features-and-benefits-list-list"><li class="features-and-benefits-list-item">EIA 0402, 0603, 0805, 1206 chip sizes available</li><li class="features-and-benefits-list-item">Small size and low weight</li><li class="features-and-benefits-list-item">Suitable for both wave and reflow soldering</li><li class="features-and-benefits-list-item">Reduction of assembly costs</li><li class="features-and-benefits-list-item">Maximum working voltage of 50V(0402, 0603), 150V(0805), 200V(1206)</li><li class="features-and-benefits-list-item">Available in ±1%, ±2% and ±5% tolerance</li><li class="features-and-benefits-list-item">Power rating of 62.5mW, 100mW and 125mW</li><li class="features-and-benefits-list-item">±400ppm/°C(1ohm to 10ohm), ±200ppm/°C(11ohm to 100ohm), ±100; Supplier 1: Farnell; Manufacturer: MULTICOMP; Manufacturer Part Number: MC0063W060311M; RoHS: Y-EX; Stock 1: 333415; Pricing 1: 10=0.0011, 100=0.001, 500=0.0009, 1000=0.0008, 2500=0.0007 (GBP); Resistance Tolerance: ± 1%; Packaging: Cut Tape; Resistor Element Material: Thick Film; Automotive Qualification Standard: -; Operating Temperature Max: 155; Operating Temperature Min: -55; Operating Temperature Range: -55°C to +155; Tape Width: 8; Temperature Coeff. -: 100; Tolerance +: 1%; Tolerance -: 1%; ComponentLink1URL: http://www.farnell.com/datasheets/1788326.pdf; ComponentLink1Description: http://www.farnell.com/datasheets/1788326.pdf; ComponentLink2URL: http://www.farnell.com/cad/1558928.zip; ComponentLink2Description: http://www.farnell.com/cad/1558928.zip; Supplier Part Number 1: 9330410
R65 = 470R: MULTICOMP - MCMR06X471 JTL - RES, CERAMIC, 470R, 5%, 0.1W, 0603; Supplier 1: Farnell; Manufacturer: MULTICOMP; Manufacturer Part Number: MCMR06X471 JTL; RoHS: Y-EX; Stock 1: 3786; Pricing 1: 10=0.0089, 100=0.0076, 500=0.0063, 1000=0.0049, 2500=0.0033, 5000=0.0024, 25000=0.0016, 50000=0.0013 (GBP); ComponentLink1URL: http://www.farnell.com/datasheets/1716707.pdf; ComponentLink1Description: http://www.farnell.com/datasheets/1716707.pdf; Supplier Part Number 1: 2073513
R66 = 10k: MULTICOMP - MCMR06X103 JTL - RES, CERAMIC, 10K, 5%, 0.1W, 0603; Resistance: 10; Voltage Rating: 75; Resistor Case Style: 0603 [1608 Metric]; Power Rating: 100; Product Range: MCMR Series; Temperature Coefficient: ± 100; Automotive Qualification Standard: -<!--FANDB--><div class="features-and-benefits-container"><div class="features-and-benefits-description"><span class="features-benefits-value">The Multicomp MCMR series resistors are automotive grade, anti sulphured thick film chip resistor. The resistance range includes E24 and E96 decade values from 1ohm to 10Mohm. These resistors are constructed on top of a high grade ceramic body.</span></div><div class="features-and-benefits-list"><ul class="features-and-benefits-list-list"><li class="features-and-benefits-list-item">EIA 0402, 0603, 0805, 1206 chip sizes available</li><li class="features-and-benefits-list-item">High reliability and stability</li><li class="features-and-benefits-list-item">Automotive grade AEC-Q200 compliant</li><li class="features-and-benefits-list-item">Complaint with (IEC 60068-1) 55/155/56 climatic category</li><li class="features-and-benefits-list-item">Maximum operation voltage of 50V, 75V, 150V and 200V</li><li class="features-and-benefits-list-item">Power rating of 62.5mW, 100mW, 125mW and 250mW</li><li class="features-and-benefits-list-item">Available in ±1% and ±5% tolerance</li><li class="features-and-benefits-list-item">Temperature coefficient (TCR) of +200ppm/°C, +100ppm/°C and -200ppm/°C to +400ppm/°C</li><li class="features-and-benefits-list-item">Operating temperature range -55°C to 155; Supplier 1: Farnell; Manufacturer: MULTICOMP; Manufacturer Part Number: MCMR06X103 JTL; RoHS: Y-EX; Stock 1: 19791; Pricing 1: 10=0.0087, 100=0.0074, 500=0.0061, 1000=0.0048, 2500=0.0032, 5000=0.0024, 25000=0.0016, 50000=0.0013 (GBP); Resistance Tolerance: ± 5%; Packaging: Cut Tape; Resistor Element Material: Ceramic; ComponentLink1URL: http://www.farnell.com/datasheets/1716707.pdf; ComponentLink1Description: http://www.farnell.com/datasheets/1716707.pdf; Supplier Part Number 1: 2073356
SB1-SB3 = Solderbridge: Artikkelnr Noca: N.A.; Part Number: Solderbridge; Manufacturer: *; Manufacturer Part Number: *; LatestRevisionDate: 2009-12-14; Pin Count: 2; Publisher: Nordic Semiconductor; Published: 2009-12-14; Value: Solderbridge; Note: *; Footprint Doc: Solderbridge; Part number IPS: N.A.; ComponentLink1URL: *; ComponentLink1Description: Datasheet; ComponentLink2URL: *; ComponentLink2Description: Supplier link; HelpURL: *; Supplier 1: *; Supplier Part Number 1: *; Supplier 2: *; Supplier Part Number 2: *
SB4-SB6 = Solderbridge Shorted: Shorted Solderbridge; Artikkelnr Noca: N.A.; Part Number: Solderbridge Shorted; Manufacturer: *; Manufacturer Part Number: *; LatestRevisionDate: 2012-08-07; Pin Count: 2; Publisher: Nordic Semiconductor; Published: 2012-08-07; Value: Solderbridge; Note: *; Footprint Doc: Solderbridge_Shorted; Part number IPS: N.A.; ComponentLink1URL: *; ComponentLink1Description: Datasheet; ComponentLink2URL: *; ComponentLink2Description: Supplier link; HelpURL: *; Supplier 1: *; Supplier Part Number 1: *; Supplier 2: *; Supplier Part Number 2: *
TP1 TP2 TP5 TP6 TP9 = TEST_POINT: Test point
U1 = PAM2306AYPKE: Voltage Regulators - Switching Regulators Dual PWM Step-Down 40uA 1A 1.5MHz; Manufacturer: Diodes Incorporated; Input Voltage: 2.5 V to 5.5 V; Input Voltage MAX: 5.5 V; Number of Outputs: 2 Output; Output Voltage: 1.8 V, 3.3 V; Topology: Buck; Input Voltage MIN: 2.5 V; Load Regulation: 0.5 %; Supplier 1: Mouser; Manufacturer Part Number: PAM2306AYPKE; RoHS: RoHS Compliant; Category: Voltage Regulators - Switching Regulators; Stock 1: 166; Pricing 1: 1=0.717, 10=0.555, 100=0.358, 1000=0.287, 3000=0.242, 9000=0.233 (EUR); Operating Temperature Range: - 40 C to + 85 C; Output Current: 1 A; Package/Case: WDFN-EP-12; Packaging: Reel; Series: PAM2306; Type: PWM Step-Down DC-DC Converter; Brand: Diodes Incorporated; Mounting Style: SMD/SMT; Shutdown: Shutdown; Switching Frequency: 1.5 MHz; Maximum Operating Temperature: + 85 C; Minimum Operating Temperature: - 40 C; Operating Supply Current: 40 uA; Standard Pack Qty: 3000; Supply Voltage - Min: 2.5 V; Tradename: PAM2306; RoHS - Mouser: Y; Minimum Order Quantity: 1; Reeling: True; ComponentLink1URL: http://www.mouser.com/ds/2/115/PAM2306-336770.pdf; ComponentLink1Description: http://www.mouser.com/ds/2/115/PAM2306-336770.pdf; Supplier Part Number 1: 621-PAM2306AYPKE